# Altium schematic sheet mcu.SchDoc
size A3
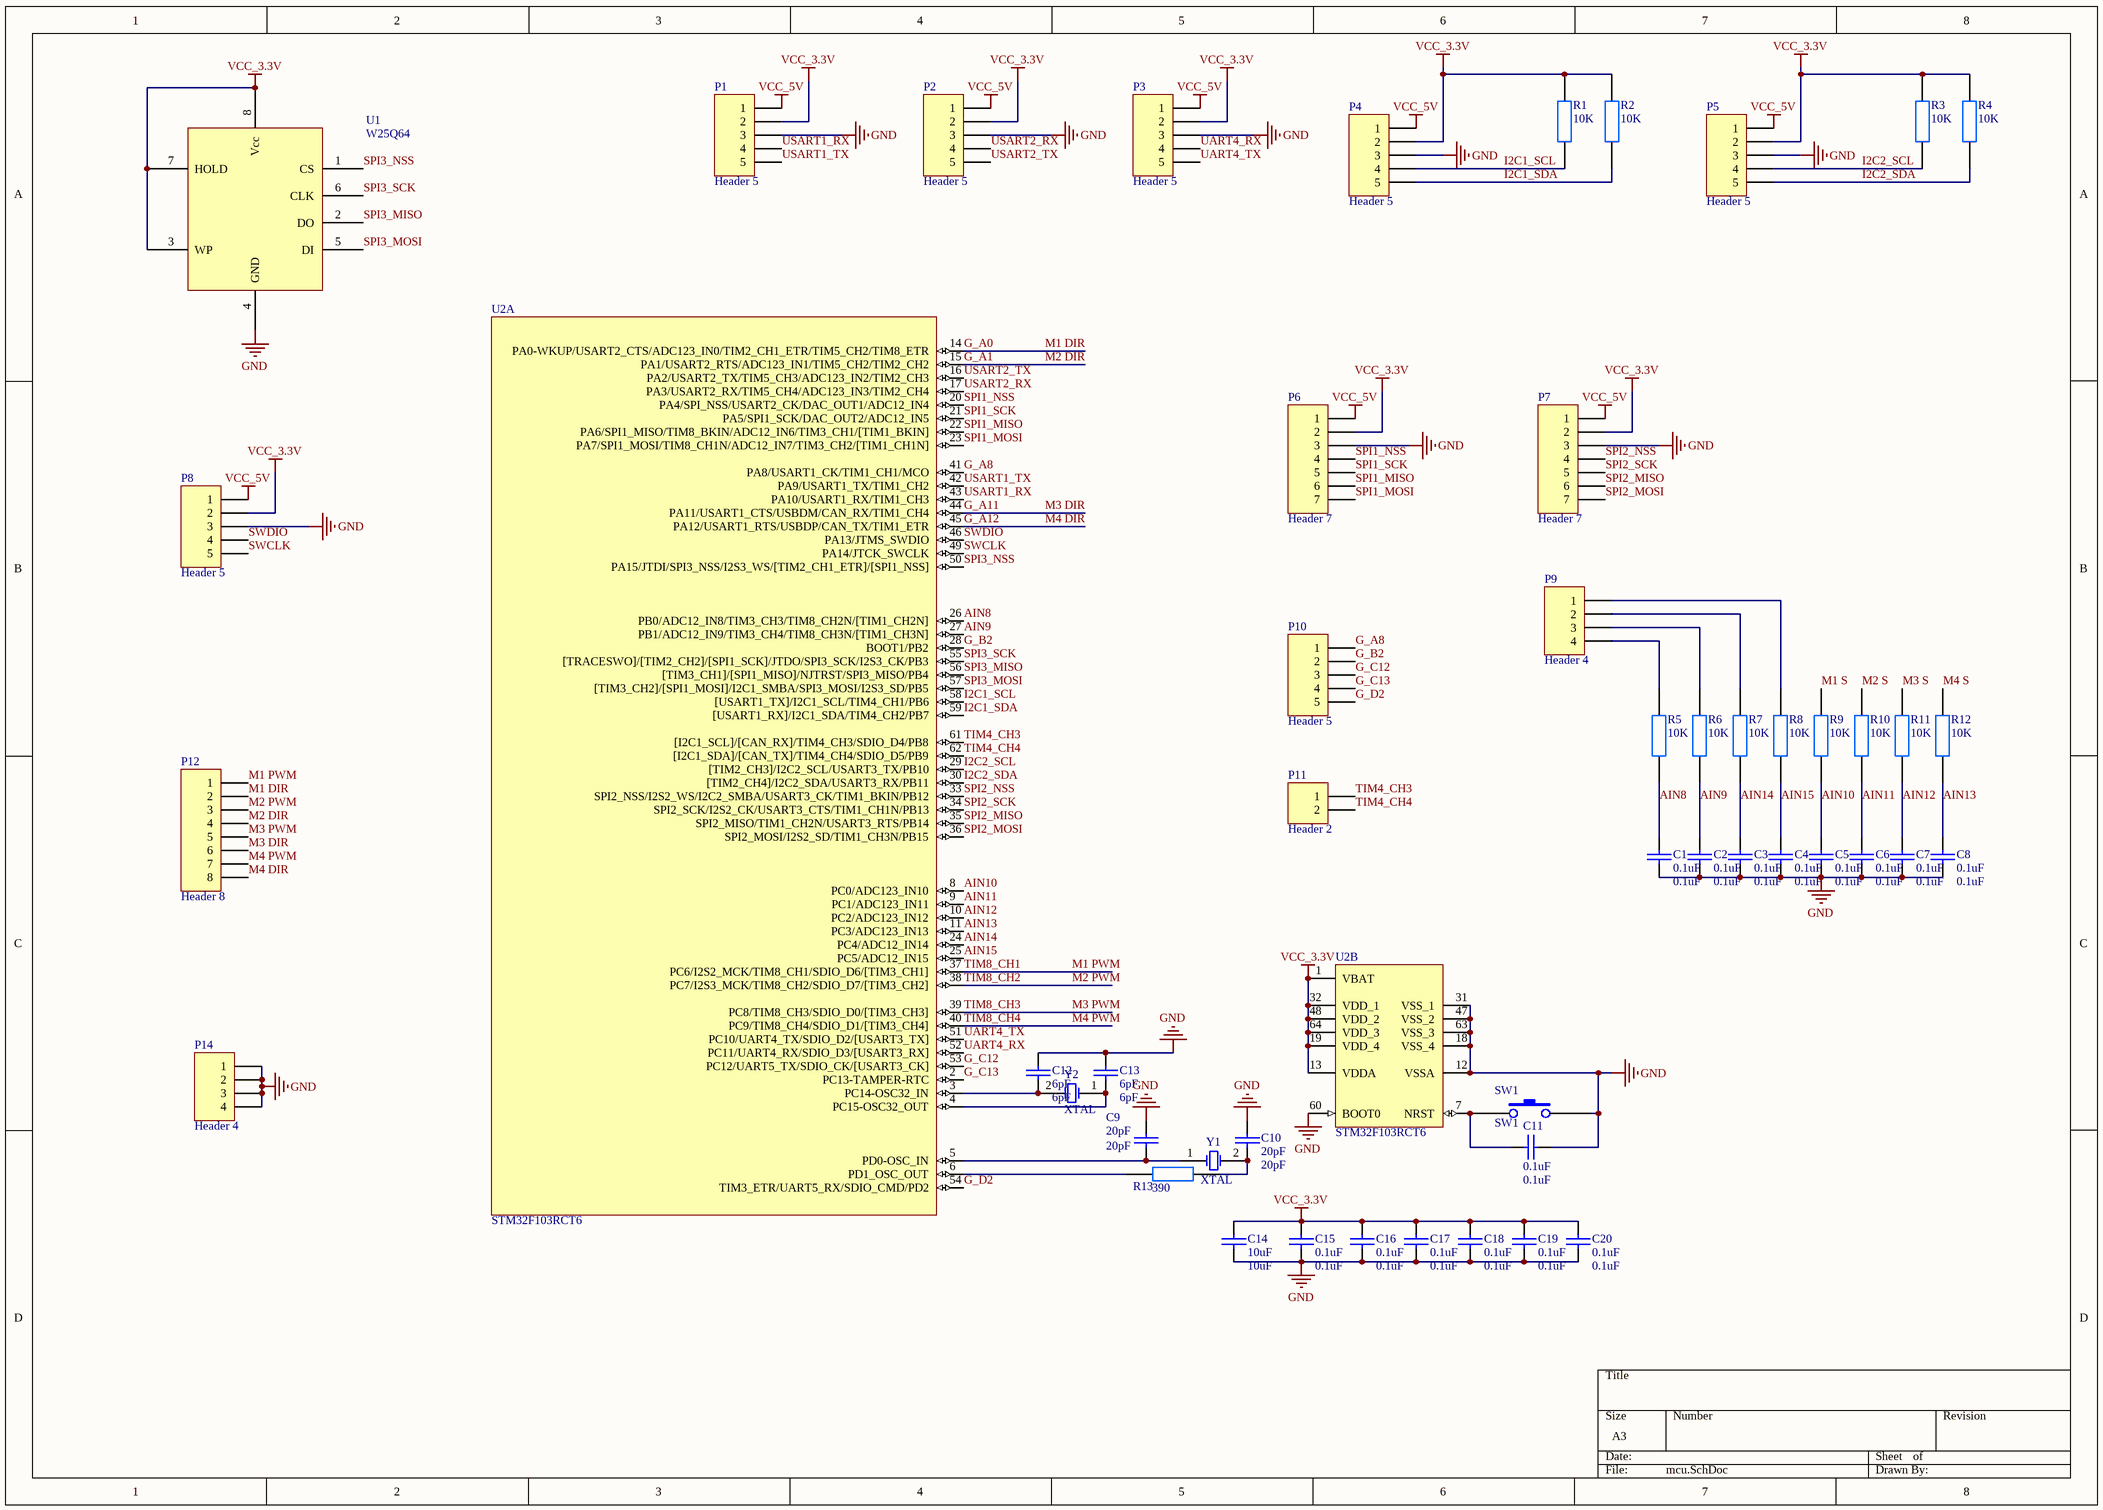
[diagram p0: mcu.SchDoc]

## Parts
C1  0.1uF  [0805 CAP]
C2  0.1uF  [0805 CAP]
C3  0.1uF  [0805 CAP]
C4  0.1uF  [0805 CAP]
C5  0.1uF  [0805 CAP]
C6  0.1uF  [0805 CAP]
C7  0.1uF  [0805 CAP]
C8  0.1uF  [0805 CAP]
C9  20pF  [0805]
C10  20pF  [0805]
C11  0.1uF  [0805 CAP]
C12  6pF  [0805]
C13  6pF  [0805]
C14  10uF  [0805 CAP]
C15  0.1uF  [0805 CAP]
C16  0.1uF  [0805 CAP]
C17  0.1uF  [0805 CAP]
C18  0.1uF  [0805 CAP]
C19  0.1uF  [0805 CAP]
C20  0.1uF  [0805 CAP]
P1  Header 5  [sip5 i]
P2  Header 5  [sip5 i]
P3  Header 5  [sip5 i]
P4  Header 5  [sip5 i]
P5  Header 5  [sip5 i]
P6  Header 7  [sip7 i]
P7  Header 7  [sip7 i]
P8  Header 5  [sip5 l]
P9  Header 4  [sip4 i]
P10  Header 5  [sip5 i]
P11  Header 2  [sip2 i]
P12  Header 8  [sip8 i]
P14  Header 4  [sip4 i]
R1  10K  [0805]
R2  10K  [0805]
R3  10K  [0805]
R4  10K  [0805]
R5  10K  [0805]
R6  10K  [0805]
R7  10K  [0805]
R8  10K  [0805]
R9  10K  [0805]
R10  10K  [0805]
R11  10K  [0805]
R12  10K  [0805]
R13  390  [0805]
SW1  SW1  [KEYA SMT]
U1  W25Q64  [so-8 fat]
U2  STM32F103RCT6  [QFP64]  (parts A,B of 2)
Y1  XTAL  [XTAL SOT]
Y2  XTAL  [xtal 26]

## Nets
GND: C1.2 C2.2 C3.2 C4.2 C5.2 C6.2 C7.2 C8.2 C9.2 C10.2 C11.2 C12.2 C13.2 C14.1 C15.1 C16.1 C17.1 C18.1 C19.1 C20.1 P1.3 P2.3 P3.3 P4.3 P5.3 P6.3 P7.3 P8.3 P14.1 P14.2 P14.3 P14.4 SW1.2 U1.4(GND) U2.12(VSSA) U2.18(VSS_4) U2.31(VSS_1) U2.47(VSS_2) U2.60(BOOT0) U2.63(VSS_3)
VCC_3.3V: C14.2 C15.2 C16.2 C17.2 C18.2 C19.2 C20.2 P1.2 P2.2 P3.2 P4.2 P5.2 P6.2 P7.2 P8.2 R1.2 R2.2 R3.2 R4.2 U1.3(WP) U1.7(HOLD) U1.8(Vcc) U2.1(VBAT) U2.13(VDDA) U2.19(VDD_4) U2.32(VDD_1) U2.48(VDD_2) U2.64(VDD_3)
VCC_5V: P1.1 P2.1 P3.1 P4.1 P5.1 P6.1 P7.1 P8.1
AIN8: C1.1 R5.1 U2.26(PB0/ADC12_IN8/TIM3_CH3/TIM8_CH2N/[TIM1_CH2N])
AIN9: C2.1 R6.1 U2.27(PB1/ADC12_IN9/TIM3_CH4/TIM8_CH3N/[TIM1_CH3N])
AIN10: C5.1 R9.1 U2.8(PC0/ADC123_IN10)
AIN11: C6.1 R10.1 U2.9(PC1/ADC123_IN11)
AIN12: C7.1 R11.1 U2.10(PC2/ADC123_IN12)
AIN13: C8.1 R12.1 U2.11(PC3/ADC123_IN13)
AIN14: C3.1 R7.1 U2.24(PC4/ADC12_IN14)
AIN15: C4.1 R8.1 U2.25(PC5/ADC12_IN15)
G_A0: P12.2 U2.14(PA0-WKUP/USART2_CTS/ADC123_IN0/TIM2_CH1_ETR/TIM5_CH2/TIM8_ETR)  [also labelled M1 DIR]
G_A1: P12.4 U2.15(PA1/USART2_RTS/ADC123_IN1/TIM5_CH2/TIM2_CH2)  [also labelled M2 DIR]
G_A8: P10.1 U2.41(PA8/USART1_CK/TIM1_CH1/MCO)
G_A11: P12.6 U2.44(PA11/USART1_CTS/USBDM/CAN_RX/TIM1_CH4)  [also labelled M3 DIR]
G_A12: P12.8 U2.45(PA12/USART1_RTS/USBDP/CAN_TX/TIM1_ETR)  [also labelled M4 DIR]
G_B2: P10.2 U2.28(BOOT1/PB2)
G_C12: P10.3 U2.53(PC12/UART5_TX/SDIO_CK/[USART3_CK])
G_C13: P10.4 U2.2(PC13-TAMPER-RTC)
G_D2: P10.5 U2.54(TIM3_ETR/UART5_RX/SDIO_CMD/PD2)
I2C1_SCL: P4.4 R1.1 U2.58([USART1_TX]/I2C1_SCL/TIM4_CH1/PB6)
I2C1_SDA: P4.5 R2.1 U2.59([USART1_RX]/I2C1_SDA/TIM4_CH2/PB7)
I2C2_SCL: P5.4 R3.1 U2.29([TIM2_CH3]/I2C2_SCL/USART3_TX/PB10)
I2C2_SDA: P5.5 R4.1 U2.30([TIM2_CH4]/I2C2_SDA/USART3_RX/PB11)
M1 PWM: P12.1 U2.37(PC6/I2S2_MCK/TIM8_CH1/SDIO_D6/[TIM3_CH1])  [also labelled TIM8_CH1]
M1 S: R9.2
M2 PWM: P12.3 U2.38(PC7/I2S3_MCK/TIM8_CH2/SDIO_D7/[TIM3_CH2])  [also labelled TIM8_CH2]
M2 S: R10.2
M3 PWM: P12.5 U2.39(PC8/TIM8_CH3/SDIO_D0/[TIM3_CH3])  [also labelled TIM8_CH3]
M3 S: R11.2
M4 PWM: P12.7 U2.40(PC9/TIM8_CH4/SDIO_D1/[TIM3_CH4])  [also labelled TIM8_CH4]
M4 S: R12.2
SPI1_MISO: P6.6 U2.22(PA6/SPI1_MISO/TIM8_BKIN/ADC12_IN6/TIM3_CH1/[TIM1_BKIN])
SPI1_MOSI: P6.7 U2.23(PA7/SPI1_MOSI/TIM8_CH1N/ADC12_IN7/TIM3_CH2/[TIM1_CH1N])
SPI1_NSS: P6.4 U2.20(PA4/SPI_NSS/USART2_CK/DAC_OUT1/ADC12_IN4)
SPI1_SCK: P6.5 U2.21(PA5/SPI1_SCK/DAC_OUT2/ADC12_IN5)
SPI2_MISO: P7.6 U2.35(SPI2_MISO/TIM1_CH2N/USART3_RTS/PB14)
SPI2_MOSI: P7.7 U2.36(SPI2_MOSI/I2S2_SD/TIM1_CH3N/PB15)
SPI2_NSS: P7.4 U2.33(SPI2_NSS/I2S2_WS/I2C2_SMBA/USART3_CK/TIM1_BKIN/PB12)
SPI2_SCK: P7.5 U2.34(SPI2_SCK/I2S2_CK/USART3_CTS/TIM1_CH1N/PB13)
SPI3_MISO: U1.2(DO) U2.56([TIM3_CH1]/[SPI1_MISO]/NJTRST/SPI3_MISO/PB4)
SPI3_MOSI: U1.5(DI) U2.57([TIM3_CH2]/[SPI1_MOSI]/I2C1_SMBA/SPI3_MOSI/I2S3_SD/PB5)
SPI3_NSS: U1.1(CS) U2.50(PA15/JTDI/SPI3_NSS/I2S3_WS/[TIM2_CH1_ETR]/[SPI1_NSS])
SPI3_SCK: U1.6(CLK) U2.55([TRACESWO]/[TIM2_CH2]/[SPI1_SCK]/JTDO/SPI3_SCK/I2S3_CK/PB3)
SWCLK: P8.5 U2.49(PA14/JTCK_SWCLK)
SWDIO: P8.4 U2.46(PA13/JTMS_SWDIO)
TIM4_CH3: P11.1 U2.61([I2C1_SCL]/[CAN_RX]/TIM4_CH3/SDIO_D4/PB8)
TIM4_CH4: P11.2 U2.62([I2C1_SDA]/[CAN_TX]/TIM4_CH4/SDIO_D5/PB9)
UART4_RX: P3.4 U2.52(PC11/UART4_RX/SDIO_D3/[USART3_RX])
UART4_TX: P3.5 U2.51(PC10/UART4_TX/SDIO_D2/[USART3_TX])
USART1_RX: P1.4 U2.43(PA10/USART1_RX/TIM1_CH3)
USART1_TX: P1.5 U2.42(PA9/USART1_TX/TIM1_CH2)
USART2_RX: P2.4 U2.17(PA3/USART2_RX/TIM5_CH4/ADC123_IN3/TIM2_CH4)
USART2_TX: P2.5 U2.16(PA2/USART2_TX/TIM5_CH3/ADC123_IN2/TIM2_CH3)
NetC9_1: C9.1 U2.5(PD0-OSC_IN) Y1.1(OSC1)
NetC10_1: C10.1 R13.2 Y1.2(OSC2)
NetC11_1: C11.1 SW1.1 U2.7(NRST)
NetC12_1: C12.1 U2.3(PC14-OSC32_IN) Y2.2(OSC2)
NetC13_1: C13.1 U2.4(PC15-OSC32_OUT) Y2.1(OSC1)
NetP9_1: P9.1 R8.2
NetP9_2: P9.2 R7.2
NetP9_3: P9.3 R6.2
NetP9_4: P9.4 R5.2
NetR13_1: R13.1 U2.6(PD1_OSC_OUT)

## Library data of the parts
C1-C20 = CAP
  C1-C8 C11 C15-C20: VALUE: 0.1uF
  C9 C10: VALUE: 20pF
  C12 C13: VALUE: 6pF
  C14: VALUE: 10uF
P1-P5 P8 P10 = Header 5: Header, 5-Pin; LatestRevisionDate: 17-Jul-2002; LatestRevisionNote: Re-released for DXP Platform.; Publisher: Altium Limited
P6 P7 = Header 7: Header, 7-Pin; LatestRevisionDate: 17-Jul-2002; LatestRevisionNote: Re-released for DXP Platform.; Publisher: Altium Limited
P9 P14 = Header 4: Header, 4-Pin; LatestRevisionDate: 17-Jul-2002; LatestRevisionNote: Re-released for DXP Platform.; Publisher: Altium Limited
P11 = Header 2: Header, 2-Pin; LatestRevisionDate: 17-Jul-2002; LatestRevisionNote: Re-released for DXP Platform.; Publisher: Altium Limited
P12 = Header 8: Header, 8-Pin; LatestRevisionDate: 17-Jul-2002; LatestRevisionNote: Re-released for DXP Platform.; Publisher: Altium Limited
R1-R13 = RES
  R1-R12: VALUE: 10K
  R13: VALUE: 390
U2 = STM32F103RCT6: STM32 ARM-based 32-bit MCU Performance Line with 256 kB Flash, 48 kB Internal RAM, -40 to +85癈 Temperature, 64-Pin LQFP, Tray; DatasheetVersion: rev8.0, Apr-2011; PackageVersion: rev13, Apr-2011; PackageReference: LQFP64; PackageDescription: 64-Pin Low-Profile Quad Flat Pack, 10 x 10 mm Body, 0.5 mm Pitch (LQFP64); ComponentLink1Description: Manufacturer URL; ComponentLink1URL: http://www.st.com/; ComponentLink2Description: STM32F103 Datasheet; ComponentLink2URL: http://www.st.com/internet/com/TECHNICAL_RESOURCES/TECHNICAL_LITERATURE/DATASHEET/CD00191185.pdf; ComponentLink3Description: STM32 Family Web Page; ComponentLink3URL: www.st.com/stm32
Y1 Y2 = XTAL: Crystal Oscillator; Published: 8-Jun-2000; LatestRevisionDate: 17-Jul-2002; LatestRevisionNote: Re-released for DXP Platform.; PackageReference: R38; Publisher: Altium Limited; PackageDescription: Crystal, Thru-Hole; 2 Leads; Body 3.1 x 8.2 mm (Dia.xH)